# Altium project 3D Printer.PrjPcb
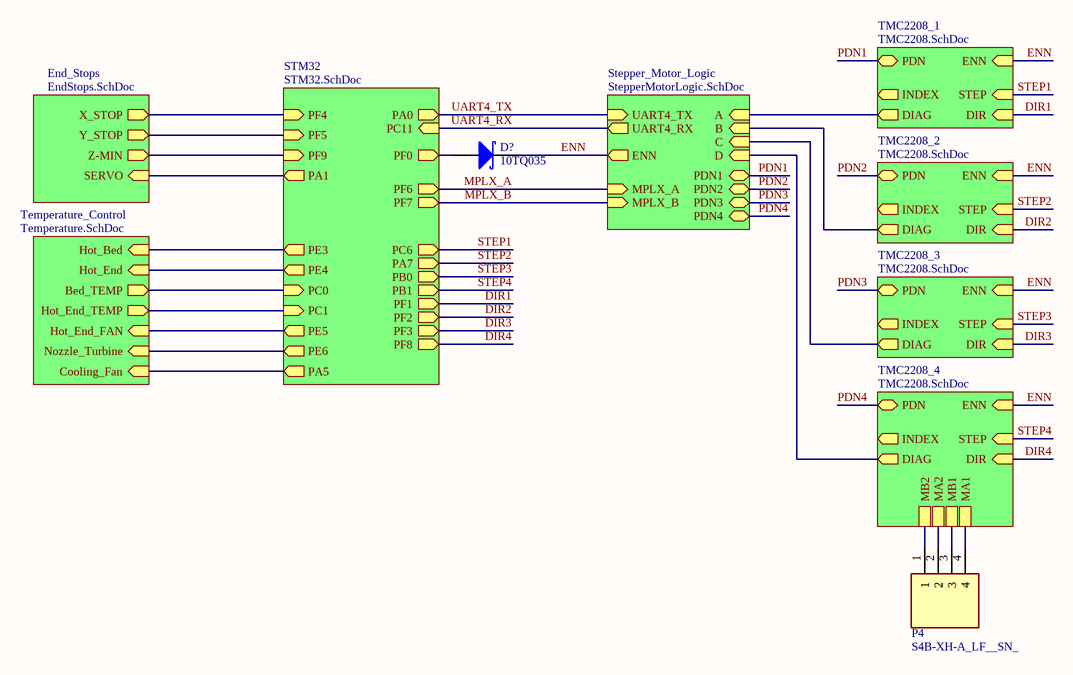
[diagram p0: Motherboard.SchDoc]
7 sheets, 256 parts. Net scope: hierarchical (ports join the sheet entries above them; power ports are global).
Board file: Motherboard.PcbDoc
Sheets:
  Motherboard.SchDoc
    TMC2208_1 = TMC2208.SchDoc
    TMC2208_2 = TMC2208.SchDoc
    TMC2208_3 = TMC2208.SchDoc
    TMC2208_4 = TMC2208.SchDoc
    STM32 = STM32.SchDoc
    Temperature_Control = Temperature.SchDoc
    Stepper_Motor_Logic = StepperMotorLogic.SchDoc
    End_Stops = EndStops.SchDoc
  PowerConversion.SchDoc

## Sheet Motherboard.SchDoc
size D

### Parts
D?  10TQ035  [TO-220AC]
P4  S4B-XH-A_LF__SN_  [SHDRRA4W64P0X250_1X4_1240X1150X700P]

### Sub-sheets
End_Stops = EndStops.SchDoc: X_STOP (out), Y_STOP (out), Z-MIN (out), SERVO (in)
Stepper_Motor_Logic = StepperMotorLogic.SchDoc: A (in), B (in), C (in), D (in), ENN (out), UART4_TX (in), UART4_RX (out), MPLX_A (in), MPLX_B (in), PDN1 (bidir), PDN2 (bidir), PDN3 (bidir), PDN4 (bidir)
STM32 = STM32.SchDoc: PA0 (out), PC11 (in), PF6 (out), PF7 (out), PF0 (out), PC6 (out), PA7 (out), PB0 (out), PB1 (out), PF8 (out), PF1 (out), PF2 (out), PF3 (out), PE3 (out), PE4 (out), PC0 (in), PC1 (in), PE5 (out), PF4 (in), PF5 (in), PE6 (out), PA5 (out), PA1 (out), PF9 (in)
Temperature_Control = Temperature.SchDoc: Hot_Bed (in), Hot_End (in), Bed_TEMP (out), Hot_End_TEMP (out), Hot_End_FAN (in), Nozzle_Turbine (in), Cooling_Fan (in)
TMC2208_1 = TMC2208.SchDoc: ENN (in), PDN (bidir), STEP (in), DIR (in), INDEX (out), DIAG (out)
TMC2208_2 = TMC2208.SchDoc: ENN (in), PDN (bidir), STEP (in), DIR (in), INDEX (out), DIAG (out)
TMC2208_3 = TMC2208.SchDoc: ENN (in), PDN (bidir), STEP (in), DIR (in), INDEX (out), DIAG (out)
TMC2208_4 = TMC2208.SchDoc: ENN (in), PDN (bidir), STEP (in), DIR (in), INDEX (out), DIAG (out), MB2, MA2, MB1, MA1

### Nets
DIR1: sheet TMC2208_1/DIR, sheet STM32/PF1  [project net DIR]
DIR2: sheet TMC2208_2/DIR, sheet STM32/PF2  [project net DIR]
DIR3: sheet TMC2208_3/DIR, sheet STM32/PF3  [project net DIR]
DIR4: sheet TMC2208_4/DIR, sheet STM32/PF8  [project net DIR]
ENN: D?.1(K) ; sheet TMC2208_1/ENN, sheet TMC2208_2/ENN, sheet TMC2208_3/ENN, sheet TMC2208_4/ENN, sheet Stepper_Motor_Logic/ENN
MPLX_A: sheet STM32/PF6, sheet Stepper_Motor_Logic/MPLX_A
MPLX_B: sheet STM32/PF7, sheet Stepper_Motor_Logic/MPLX_B
PDN1: sheet TMC2208_1/PDN, sheet Stepper_Motor_Logic/PDN1
PDN2: sheet TMC2208_2/PDN, sheet Stepper_Motor_Logic/PDN2
PDN3: sheet TMC2208_3/PDN, sheet Stepper_Motor_Logic/PDN3
PDN4: sheet TMC2208_4/PDN, sheet Stepper_Motor_Logic/PDN4
STEP1: sheet TMC2208_1/STEP, sheet STM32/PC6
STEP2: sheet TMC2208_2/STEP, sheet STM32/PA7
STEP3: sheet TMC2208_3/STEP, sheet STM32/PB0
STEP4: sheet TMC2208_4/STEP, sheet STM32/PB1
UART4_RX: sheet STM32/PC11, sheet Stepper_Motor_Logic/UART4_RX
UART4_TX: sheet STM32/PA0, sheet Stepper_Motor_Logic/UART4_TX
Net1_1: sheet STM32/PC0, sheet Temperature_Control/Bed_TEMP
NetC10_TMC2208_4_2: P4.4 ; sheet TMC2208_4/MA1
NetC11_TMC2208_4_2: P4.3 ; sheet TMC2208_4/MB1
NetC12_TMC2208_4_1: P4.2 ; sheet TMC2208_4/MA2
NetC13_TMC2208_4_1: P4.1 ; sheet TMC2208_4/MB2
NetC42_2: sheet STM32/PC1, sheet Temperature_Control/Hot_End_TEMP
NetD?_3: D?.3(A) ; sheet STM32/PF0
NetIC1_TMC2208_1_11: sheet TMC2208_1/DIAG, sheet Stepper_Motor_Logic/A
NetIC1_TMC2208_2_11: sheet TMC2208_2/DIAG, sheet Stepper_Motor_Logic/B
NetIC1_TMC2208_3_11: sheet TMC2208_3/DIAG, sheet Stepper_Motor_Logic/C
NetIC1_TMC2208_4_11: sheet TMC2208_4/DIAG, sheet Stepper_Motor_Logic/D
NetP?#3_1: sheet STM32/PA1, sheet End_Stops/SERVO
NetP?#4_1: sheet STM32/PF9, sheet End_Stops/Z-MIN
NetR2_2: sheet STM32/PE3, sheet Temperature_Control/Hot_Bed
NetR23_2: sheet STM32/PE5, sheet Temperature_Control/Hot_End_FAN
NetR31_2: sheet STM32/PE4, sheet Temperature_Control/Hot_End
NetR?#1_2: sheet STM32/PE6, sheet Temperature_Control/Nozzle_Turbine
NetR?#2_2: sheet STM32/PA5, sheet Temperature_Control/Cooling_Fan
NetR?#13_2: sheet STM32/PF4, sheet End_Stops/X_STOP
NetR?#14_2: sheet STM32/PF5, sheet End_Stops/Y_STOP

### Library data of the parts
D? = Diode 10TQ035: Schottky Rectifier; Note: Terminal 2 is the TAB and is electrically connected to the cathode; Published: 8-Jun-2000; LatestRevisionDate: 17-Jul-2002; LatestRevisionNote: Re-released for DXP Platform.; DatasheetVersion: PD-2.057B; PackageVersion: Feb-1998; PackageReference: TO-220AC; Publisher: Altium Limited; PackageDescription: TO, Thru-Hole, Vertical, Heatsink Mounted; 3 In-Line Leads (1 Absent); Pitch 2.54 mm; ComponentLink1Description: Manufacturer Link; ComponentLink1URL: http://www.irf.com/; ComponentLink2Description: Datasheet; ComponentLink2URL: http://www.irf.com/product-info/datasheets/data/10tq.pdf
P4 = S4B-XH-A_LF__SN_: Connector; Manufacturer_Name: JST (JAPAN SOLDERLESS TERMINALS); Manufacturer_Part_Number: S4B-XH-A(LF)(SN); Datasheet Link: http://www.jst-mfg.com/product/pdf/eng/eXH.pdf; Height: 7mm; Arrow Part Number: S4B-XH-A(LF)(SN); Arrow Price/Stock: https://www.arrow.com/en/products/s4b-xh-a-lf-sn/jst-manufacturing

## Sheet TMC2208.SchDoc
size B
Used 4 times, as channels TMC2208_1, TMC2208_2, TMC2208_3, TMC2208_4. Parts and nets are listed once, with the designators drawn on the sheet.
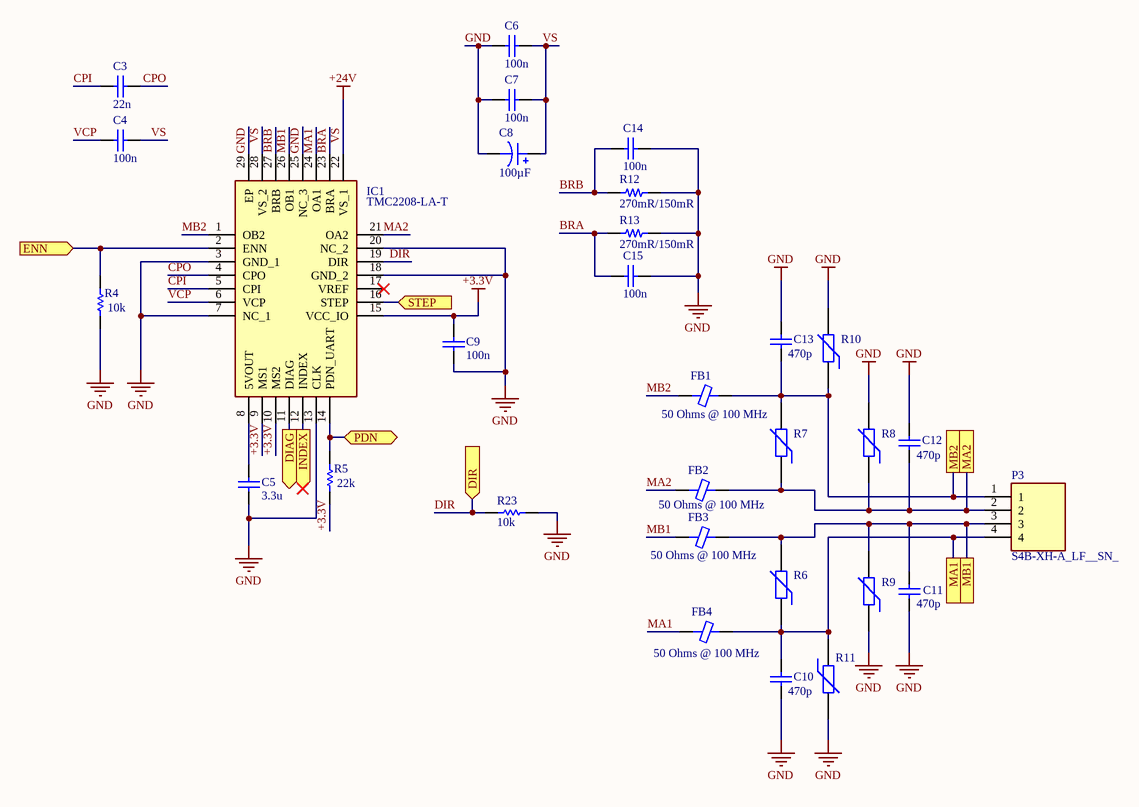
[diagram p1: TMC2208.SchDoc]

### Parts
C3  value 22n  [RAD-0.3]  (hidden comment: Cap)
C4  value 100n  [RAD-0.3]  (hidden comment: Cap)
C5  value 3.3u  [RAD-0.3]  (hidden comment: Cap)
C6  value 100n  [RAD-0.3]  (hidden comment: Cap)
C7  value 100n  [RAD-0.3]  (hidden comment: Cap)
C8  100µF  [CAP ALSMD 8.3MM H10.5MM]
C9  value 100n  [RAD-0.3]  (hidden comment: Cap)
C10  value 470p  [RAD-0.3]  (hidden comment: Cap)
C11  value 470p  [RAD-0.3]  (hidden comment: Cap)
C12  value 470p  [RAD-0.3]  (hidden comment: Cap)
C13  value 470p  [RAD-0.3]  (hidden comment: Cap)
C14  value 100n  [RAD-0.3]  (hidden comment: Cap)
C15  value 100n  [RAD-0.3]  (hidden comment: Cap)
FB1  50 Ohms @ 100 MHz  [FER 1206_3216]
FB2  50 Ohms @ 100 MHz  [FER 1206_3216]
FB3  50 Ohms @ 100 MHz  [FER 1206_3216]
FB4  50 Ohms @ 100 MHz  [FER 1206_3216]
IC1  TMC2208-LA-T  [QFN50P500X500X90-29N-D]
P3  S4B-XH-A_LF__SN_  [SHDRRA4W64P0X250_1X4_1240X1150X700P]
R4  value 10k  [AXIAL-0.3]  (hidden comment: Res1)
R5  value 22k  [AXIAL-0.3]  (hidden comment: Res1)
R6  Res Varistor  [6-0805_N]  (value not drawn)
R7  Res Varistor  [6-0805_N]  (value not drawn)
R8  Res Varistor  [6-0805_N]  (value not drawn)
R9  Res Varistor  [6-0805_N]  (value not drawn)
R10  Res Varistor  [6-0805_N]  (value not drawn)
R11  Res Varistor  [6-0805_N]  (value not drawn)
R12  270mR/150mR  [RES 2512_6432]
R13  270mR/150mR  [RES 2512_6432]
R23  value 10k  [AXIAL-0.3]  (hidden comment: Res1)

### Ports
DIAG (out), DIR (in), ENN (in), INDEX (out), MA1, MA2, MB1, MB2, PDN (bidir), STEP (in)

### Nets
+3.3V: C9.1 IC1.9(MS1) IC1.10(MS2) IC1.15(VCC_IO) R5.1
GND: C5.2 C6.2 C7.2 C8.2 C9.2 C10.1 C11.1 C12.2 C13.2 C14.1 C15.1 IC1.3(GND_1) IC1.7(NC_1) IC1.13(CLK) IC1.18(GND_2) IC1.20(NC_2) IC1.25(NC_3) IC1.29(EP) R4.1 R8.2 R9.1 R10.2 R11.2 R12.1 R13.1 R23.2
VS: C4.1 C6.1 C7.1 C8.1 IC1.22(VS_1) IC1.28(VS_2)  [also labelled +24V]
BRA: C15.2 IC1.23(BRA) R13.2
BRB: C14.2 IC1.27(BRB) R12.2
CPI: C3.2 IC1.5(CPI)
CPO: C3.1 IC1.4(CPO)
DIAG: IC1.11(DIAG) ; port DIAG
DIR: IC1.19(DIR) R23.1 ; port DIR
ENN: IC1.2(ENN) R4.2 ; port ENN
INDEX: IC1.12(INDEX) ; port INDEX
MA1: FB4.1 IC1.24(OA1)
MA1: C10.2 FB4.2 P3.4 R6.1 R11.1 ; port MA1  [a separate net that carries the same name]
MA2: FB2.1 IC1.21(OA2)
MA2: C12.1 FB2.2 P3.2 R7.1 R8.1 ; port MA2  [a separate net that carries the same name]
MB1: FB3.1 IC1.26(OB1)
MB1: C11.2 FB3.2 P3.3 R6.2 R9.2 ; port MB1  [a separate net that carries the same name]
MB2: FB1.1 IC1.1(OB2)
MB2: C13.1 FB1.2 P3.1 R7.2 R10.1 ; port MB2  [a separate net that carries the same name]
PDN: IC1.14(PDN_UART) R5.2 ; port PDN
STEP: IC1.16(STEP) ; port STEP
VCP: C4.2 IC1.6(VCP)
NetC5_1: C5.1 IC1.8(5VOUT)

Not connected (* = marked no-connect by the designer): IC1 17(VREF)*

### Channels
TMC2208_1: designators C3=C3_TMC2208_1 C4=C4_TMC2208_1 C5=C5_TMC2208_1 C6=C6_TMC2208_1 C7=C7_TMC2208_1 C8=C8_TMC2208_1 C9=C9_TMC2208_1 C10=C10_TMC2208_1 C11=C11_TMC2208_1 C12=C12_TMC2208_1 C13=C13_TMC2208_1 C14=C14_TMC2208_1 C15=C15_TMC2208_1 FB1=FB1_TMC2208_1 FB2=FB2_TMC2208_1 FB3=FB3_TMC2208_1 FB4=FB4_TMC2208_1 IC1=IC1_TMC2208_1 P3=J3_TMC2208_1 R4=R4_TMC2208_1 R5=R5_TMC2208_1 R6=R6_TMC2208_1 R7=R7_TMC2208_1 R8=R8_TMC2208_1 R9=R9_TMC2208_1 R10=R10_TMC2208_1 R11=R11_TMC2208_1 R12=R12_TMC2208_1 R13=R13_TMC2208_1 R23=R23_TMC2208_1; ports DIAG=NetIC1_TMC2208_1_11 DIR=DIR ENN=ENN INDEX=NetIC1_TMC2208_1_12 MA1=NetC10_TMC2208_1_2 MA2=NetC12_TMC2208_1_1 MB1=NetC11_TMC2208_1_2 MB2=NetC13_TMC2208_1_1 PDN=PDN1 STEP=STEP1
TMC2208_2: designators C3=C3_TMC2208_2 C4=C4_TMC2208_2 C5=C5_TMC2208_2 C6=C6_TMC2208_2 C7=C7_TMC2208_2 C8=C8_TMC2208_2 C9=C9_TMC2208_2 C10=C10_TMC2208_2 C11=C11_TMC2208_2 C12=C12_TMC2208_2 C13=C13_TMC2208_2 C14=C14_TMC2208_2 C15=C15_TMC2208_2 FB1=FB1_TMC2208_2 FB2=FB2_TMC2208_2 FB3=FB3_TMC2208_2 FB4=FB4_TMC2208_2 IC1=IC1_TMC2208_2 P3=J3_TMC2208_2 R4=R4_TMC2208_2 R5=R5_TMC2208_2 R6=R6_TMC2208_2 R7=R7_TMC2208_2 R8=R8_TMC2208_2 R9=R9_TMC2208_2 R10=R10_TMC2208_2 R11=R11_TMC2208_2 R12=R12_TMC2208_2 R13=R13_TMC2208_2 R23=R23_TMC2208_2; ports DIAG=NetIC1_TMC2208_2_11 DIR=DIR ENN=ENN INDEX=NetIC1_TMC2208_2_12 MA1=NetC10_TMC2208_2_2 MA2=NetC12_TMC2208_2_1 MB1=NetC11_TMC2208_2_2 MB2=NetC13_TMC2208_2_1 PDN=PDN2 STEP=STEP2
TMC2208_3: designators C3=C3_TMC2208_3 C4=C4_TMC2208_3 C5=C5_TMC2208_3 C6=C6_TMC2208_3 C7=C7_TMC2208_3 C8=C8_TMC2208_3 C9=C9_TMC2208_3 C10=C10_TMC2208_3 C11=C11_TMC2208_3 C12=C12_TMC2208_3 C13=C13_TMC2208_3 C14=C14_TMC2208_3 C15=C15_TMC2208_3 FB1=FB1_TMC2208_3 FB2=FB2_TMC2208_3 FB3=FB3_TMC2208_3 FB4=FB4_TMC2208_3 IC1=IC1_TMC2208_3 P3=J3_TMC2208_3 R4=R4_TMC2208_3 R5=R5_TMC2208_3 R6=R6_TMC2208_3 R7=R7_TMC2208_3 R8=R8_TMC2208_3 R9=R9_TMC2208_3 R10=R10_TMC2208_3 R11=R11_TMC2208_3 R12=R12_TMC2208_3 R13=R13_TMC2208_3 R23=R23_TMC2208_3; ports DIAG=NetIC1_TMC2208_3_11 DIR=DIR ENN=ENN INDEX=NetIC1_TMC2208_3_12 MA1=NetC10_TMC2208_3_2 MA2=NetC12_TMC2208_3_1 MB1=NetC11_TMC2208_3_2 MB2=NetC13_TMC2208_3_1 PDN=PDN3 STEP=STEP3
TMC2208_4: designators C3=C3_TMC2208_4 C4=C4_TMC2208_4 C5=C5_TMC2208_4 C6=C6_TMC2208_4 C7=C7_TMC2208_4 C8=C8_TMC2208_4 C9=C9_TMC2208_4 C10=C10_TMC2208_4 C11=C11_TMC2208_4 C12=C12_TMC2208_4 C13=C13_TMC2208_4 C14=C14_TMC2208_4 C15=C15_TMC2208_4 FB1=FB1_TMC2208_4 FB2=FB2_TMC2208_4 FB3=FB3_TMC2208_4 FB4=FB4_TMC2208_4 IC1=IC1_TMC2208_4 P3=J3_TMC2208_4 R4=R4_TMC2208_4 R5=R5_TMC2208_4 R6=R6_TMC2208_4 R7=R7_TMC2208_4 R8=R8_TMC2208_4 R9=R9_TMC2208_4 R10=R10_TMC2208_4 R11=R11_TMC2208_4 R12=R12_TMC2208_4 R13=R13_TMC2208_4 R23=R23_TMC2208_4; ports DIAG=NetIC1_TMC2208_4_11 DIR=DIR ENN=ENN INDEX=NetIC1_TMC2208_4_12 MA1=NetC10_TMC2208_4_2 MA2=NetC12_TMC2208_4_1 MB1=NetC11_TMC2208_4_2 MB2=NetC13_TMC2208_4_1 PDN=PDN4 STEP=STEP4

### Notes on the sheet
- Shortest possible loop
- Shortest path to GND, Isolated from each other
- (near R5) Short wire

### Library data of the parts
C3-C7 C9-C15 = Cap: Capacitor; Published: 8-Jun-2000; LatestRevisionDate: 17-Jul-2002; LatestRevisionNote: Re-released for DXP Platform.; PackageReference: RAD-0.3; Publisher: Altium Limited; PackageDescription: Radial Cap, Thru-Hole; 2 Leads; 0.3 in Pin Spacing
C8 = UUX1V101MNL6GS: CAP ALUM 100UF 20% 35V SMD; manufacturer: Nichicon; Lifetime @ Temp.: 2000 Hrs @ 105°C; Polarization: Polar; Ripple Current @ High Frequency: 367.9mA @ 10kHz; Ripple Current @ Low Frequency: 283mA @ 120Hz; Surface Mount Land Size: 0.327" L x 0.327" W (8.30mm x 8.30mm); Part Number: UUX1V101MNL6GS; Applications: General Purpose; Capacitance: 100µF; componentlink1description: Datasheet; componentlink1url: http://nichicon-us.com/english/products/pdfs/e-uux.pdf; componentlink2description: DigiKey Link; componentlink2url: http://digikey.com/product-detail/en/nichicon/UUX1V101MNL6GS/493-6276-1-ND/3438789; Device Package: Radial, Can - SMD; Height - Seated (Max): 0.413" (10.50mm); lastupdated: 02.09.2020 01:25:15; Lifecycle Status: Active; Minimum Order: 1; Mounting Type: Surface Mount; Operating Temperature: -55°C ~ 105°C; Package / Case: Radial, Can - SMD; packaging: TapeAndReel; partid: 7565; Part Status: Active; price: 0.19; series: UUX; Size / Dimension: 0.315" Dia (8.00mm); Supplier 1: DigiKey; Supplier Part Number 1: 493-6276-1-ND; Tolerance: ±20%; value: 100µF; Voltage - Rated: 35V
FB1-FB4 = ILHB1206ER500V: FERRITE BEAD 50 OHM 1206 1LN; Manufacturer: Vishay Dale; Current Rating (Max): 6A; DC Resistance (DCR) (Max): 20mOhm; Number of Lines: 1; Part Number: ILHB1206ER500V; ComponentLink1Description: Datasheet; ComponentLink1URL: http://www.vishay.com/docs/34102/ilhb.pdf; ComponentLink2Description: DigiKey Link; ComponentLink2URL: https://www.digikey.com/en/products/detail/vishay-dale/ILHB1206ER500V/2575024; Device Package: 1206 (3216 Metric); Height (Max): 0.051" (1.30mm); Impedance @ Frequency: 50 Ohms @ 100 MHz; LastUpdated: 31.07.2022 00:06:55; Lifecycle Status: Active; Minimum Order: 1; Mounting Type: Surface Mount; Operating Temperature: -55°C ~ 125°C; Package / Case: 1206 (3216 Metric); Packaging: TapeAndReel; PartId: 1687; Part Status: Active; Price: 0.06; Series: ILHB; Size / Dimension: 0.126" L x 0.063" W (3.20mm x 1.60mm); Supplier 1: DigiKey; Supplier Part Number 1: 541-2606-1-ND; Value: 50 Ohms @ 100 MHz
IC1 = TMC2208-LA-T: Integrated Circuit; Manufacturer_Name: TRINAMIC; Datasheet Link: https://datasheet.datasheetarchive.com/originals/distributors/DKDS-23/450911.pdf; Height: 0.9mm; Manufacturer_Part_Number: TMC2208-LA-T; Mouser Part Number: 700-TMC2208-LA-T; Mouser Price/Stock: https://www.mouser.co.uk/ProductDetail/Trinamic/TMC2208-LA-T?qs=TiOZkKH1s2TUCbyrI5xF3A%3D%3D
P3 = S4B-XH-A_LF__SN_: as P4 on sheet Motherboard; Datasheet Link: http://www.jst-mfg.com/product/pdf/eng/eXH.pdf; Height: 7mm; Arrow Part Number: S4B-XH-A(LF)(SN); Arrow Price/Stock: https://www.arrow.com/en/products/s4b-xh-a-lf-sn/jst-manufacturing
R4 R5 R23 = Res1: Resistor; Published: 8-Jun-2000; LatestRevisionDate: 17-Jul-2002; LatestRevisionNote: Re-released for DXP Platform.; PackageReference: AXIAL-0.3; Publisher: Altium Limited; PackageDescription: Axial Device, Thru-Hole; 2 Leads; 0.3 in Pin Spacing
R6-R11 = Res Varistor: Varistor (Voltage-Sensitive Resistor); Published: 24-Mar-1999; LatestRevisionDate: 29-May-2009; LatestRevisionNote: IPC-7351 Footprint Added.; PackageVersion: Mar-2003; PackageReference: 6-0805; Publisher: Altium Limited; PackageDescription: Chip Resistor 0805 Case Size; Code_IPC: RESC2012
R12 R13 = RL73H3AR27FTDF: RES 0.27 OHM 1% 1W 2512; Manufacturer: TE Connectivity Passive Product; Resistance: 270 mOhms; Temperature Coefficient: ±100ppm/°C; Value: 270 mOhms; Part Number: RL73H3AR27FTDF; ComponentLink1Description: Datasheet; ComponentLink1URL: https://www.te.com/commerce/DocumentDelivery/DDEController?Action=srchrtrv&DocNm=1773269&DocType=DS&DocLang=English; ComponentLink2Description: DigiKey Link; ComponentLink2URL: http://digikey.com/product-detail/en/te-connectivity-passive-product/RL73H3AR27FTDF/A138622CT-ND/9372023; Composition: Thick Film; Device Package: 2512 (6432 Metric); Features: Current Sense; Height - Seated (Max): 0.028" (0.70mm); LastUpdated: 02.09.2020 01:26:50; Lifecycle Status: Active; Minimum Order: 1; Number of Terminations: 2; Operating Temperature: -55°C ~ 155°C; Package / Case: 2512 (6432 Metric); Packaging: TapeAndReel; Part Status: Active; Power (Watts): 1W; Price: 0.19; Series: RL73, CGS; Size / Dimension: 0.250" L x 0.122" W (6.35mm x 3.10mm); Supplier 1: DigiKey; Supplier Part Number 1: A138622CT-ND; Supplier Device Package: 2512; Tolerance: ±1%

## Sheet STM32.SchDoc
size B
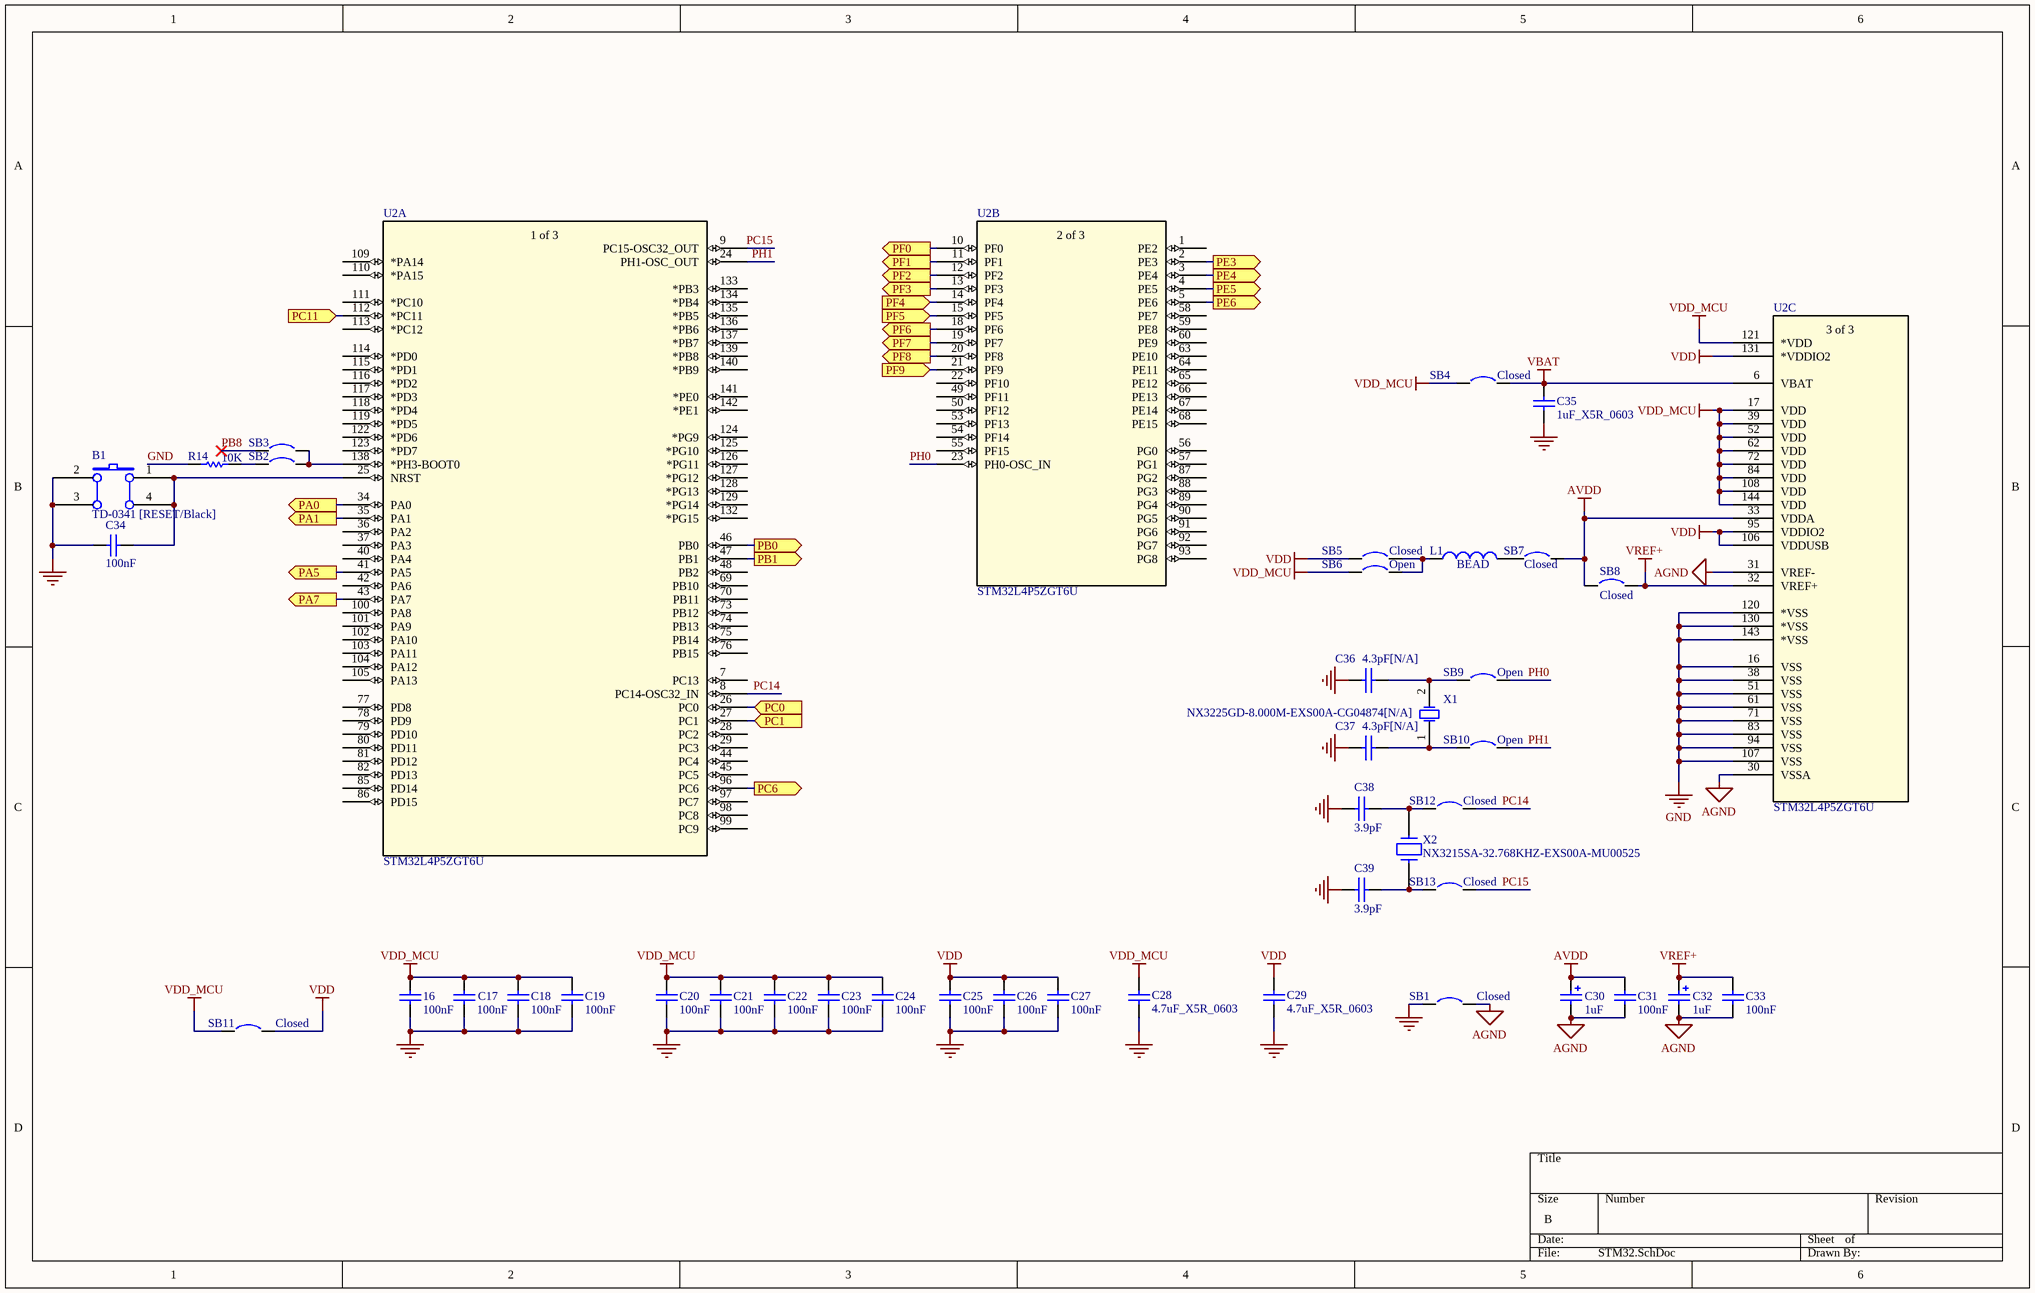
[diagram p2: STM32.SchDoc]

### Parts
16  100nF  [0603C]
B1  TD-0341 [RESET/Black]  [PB-6X6mm-Black]
C17  100nF  [0603C]
C18  100nF  [0603C]
C19  100nF  [0603C]
C20  100nF  [0603C]
C21  100nF  [0603C]
C22  100nF  [0603C]
C23  100nF  [0603C]
C24  100nF  [0603C]
C25  100nF  [0603C]
C26  100nF  [0603C]
C27  100nF  [0603C]
C28  4.7uF_X5R_0603  [0603C]
C29  4.7uF_X5R_0603  [0603C]
C30  value 1uF  [TAN-A]  (hidden comment: TAJA105K016R)
C31  100nF  [0603C]
C32  value 1uF  [TAN-A]  (hidden comment: TAJA105K016R)
C33  100nF  [0603C]
C34  100nF  [0603C]
C35  1uF_X5R_0603  [0603C]
C36  4.3pF[N/A]  [0603C]
C37  4.3pF[N/A]  [0603C]
C38  3.9pF  [0603C]
C39  3.9pF  [0603C]
L1  BEAD  [0603L]
R14  10K  [0603R]
SB1  Closed  [SB_0603]
SB2  Circuit Breaker  [SB_0603]  (value not drawn)
SB3  Circuit Breaker  [SB_0603]  (value not drawn)
SB4  Closed  [SB_0603]
SB5  Closed  [SB_0603]
SB6  Open  [SB_0603]
SB7  Closed  [SB_0603]
SB8  Closed  [SB_0603]
SB9  Open  [SB_0603]
SB10  Open  [SB_0603]
SB11  Closed  [SB_0603]
SB12  Closed  [SB_0603]
SB13  Closed  [SB_0603]
U2  STM32L4P5ZGT6U  [LQFP144_STM32_STM]  (parts A,B,C of 3)
X1  NX3225GD-8.000M-EXS00A-CG04874[N/A]  [OSC_2SM_3R2x2R5]
X2  NX3215SA-32.768KHZ-EXS00A-MU00525  [XTAL_2SM_3R2X1R5]

### Ports
PA0 (out), PA1 (out), PA5 (out), PA7 (out), PB0 (out), PB1 (out), PC0 (in), PC1 (in), PC6 (out), PC11 (in), PE3 (out), PE4 (out), PE5 (out), PE6 (out), PF0 (out), PF1 (out), PF2 (out), PF3 (out), PF4 (in), PF5 (in), PF6 (out), PF7 (out), PF8 (out), PF9 (in)

### Nets
AGND: C30.2 C31.2 C32.2 C33.2 SB1.2 U2.30(VSSA) U2.31(VREF-)
AVDD: C30.1 C31.1 SB7.2 SB8.1 U2.33(VDDA)
GND: 16.2 B1.2(B0) B1.3(B1) C17.2 C18.2 C19.2 C20.2 C21.2 C22.2 C23.2 C24.2 C25.2 C26.2 C27.2 C28.2 C29.2 C34.2 C35.2 C36.2 C37.2 C38.2 C39.2 R14.2 SB1.1 U2.16(VSS) U2.38(VSS) U2.51(VSS) U2.61(VSS) U2.71(VSS) U2.83(VSS) U2.94(VSS) U2.107(VSS) U2.120(*VSS) U2.130(*VSS) U2.143(*VSS)
VBAT: C35.1 SB4.2 U2.6(VBAT)
VDD: C25.1 C26.1 C27.1 C29.1 SB5.1 SB11.2 U2.95(VDDIO2) U2.106(VDDUSB) U2.131(*VDDIO2)
VDD_MCU: 16.1 C17.1 C18.1 C19.1 C20.1 C21.1 C22.1 C23.1 C24.1 C28.1 SB4.1 SB6.1 SB11.1 U2.17(VDD) U2.39(VDD) U2.52(VDD) U2.62(VDD) U2.72(VDD) U2.84(VDD) U2.108(VDD) U2.121(*VDD) U2.144(VDD)
VREF+: C32.1 C33.1 SB8.2 U2.32(VREF+)
DIR: U2.11(PF1) ; port PF1
DIR: U2.12(PF2) ; port PF2  [a separate net that carries the same name]
DIR: U2.13(PF3) ; port PF3  [a separate net that carries the same name]
DIR: U2.20(PF8) ; port PF8  [a separate net that carries the same name]
MPLX_A: U2.18(PF6) ; port PF6
MPLX_B: U2.19(PF7) ; port PF7
PB8: SB3.1
PC14: SB12.2 U2.8(PC14-OSC32_IN)
PC15: SB13.2 U2.9(PC15-OSC32_OUT)
PH0: SB9.2 U2.23(PH0-OSC_IN)
PH1: SB10.2 U2.24(PH1-OSC_OUT)
STEP1: U2.96(PC6) ; port PC6
STEP2: U2.43(PA7) ; port PA7
STEP3: U2.46(PB0) ; port PB0
STEP4: U2.47(PB1) ; port PB1
UART4_RX: U2.112(*PC11) ; port PC11
UART4_TX: U2.34(PA0) ; port PA0
Net1_1: U2.26(PC0) ; port PC0
NetB1_1: B1.1(A0) B1.4(A1) C34.1 U2.25(NRST)
NetC36_1: C36.1 SB9.1 X1.2(OSC2)
NetC37_1: C37.1 SB10.1 X1.1(OSC1)
NetC38_1: C38.1 SB12.1 X2.1
NetC39_1: C39.1 SB13.1 X2.2
NetC42_2: U2.27(PC1) ; port PC1
NetD?_3: U2.10(PF0) ; port PF0
NetL1_1: L1.1 SB5.2 SB6.2
NetL1_2: L1.2 SB7.1
NetP?#3_1: U2.35(PA1) ; port PA1
NetP?#4_1: U2.21(PF9) ; port PF9
NetR2_2: U2.2(PE3) ; port PE3
NetR14_1: R14.1 SB2.1
NetR23_2: U2.4(PE5) ; port PE5
NetR31_2: U2.3(PE4) ; port PE4
NetR?#1_2: U2.5(PE6) ; port PE6
NetR?#2_2: U2.41(PA5) ; port PA5
NetR?#13_2: U2.14(PF4) ; port PF4
NetR?#14_2: U2.15(PF5) ; port PF5
NetSB2_2: SB2.2 SB3.2 U2.138(*PH3-BOOT0)

Not connected (* = marked no-connect by the designer): U2 1(PE2) 7(PC13) 22(PF10) 28(PC2) 29(PC3) 36(PA2) 37(PA3) 40(PA4) 42(PA6) 44(PC4) 45(PC5) 48(PB2) 49(PF11) 50(PF12) 53(PF13) 54(PF14) 55(PF15) 56(PG0) 57(PG1) 58(PE7) 59(PE8) 60(PE9) 63(PE10) 64(PE11) 65(PE12) 66(PE13) 67(PE14) 68(PE15) 69(PB10) 70(PB11) 73(PB12) 74(PB13) 75(PB14) 76(PB15) 77(PD8) 78(PD9) 79(PD10) 80(PD11) 81(PD12) 82(PD13) 85(PD14) 86(PD15) 87(PG2) 88(PG3) 89(PG4) 90(PG5) 91(PG6) 92(PG7) 93(PG8) 97(PC7) 98(PC8) 99(PC9) 100(PA8) 101(PA9) 102(PA10) 103(PA11) 104(PA12) 105(PA13) 109(*PA14) 110(*PA15) 111(*PC10) 113(*PC12) 114(*PD0) 115(*PD1) 116(*PD2) 117(*PD3) 118(*PD4) 119(*PD5) 122(*PD6) 123(*PD7) 124(*PG9) 125(*PG10) 126(*PG11) 127(*PG12) 128(*PG13) 129(*PG14) 132(*PG15) 133(*PB3) 134(*PB4) 135(*PB5) 136(*PB6) 137(*PB7) 139(*PB8) 140(*PB9) 141(*PE0) 142(*PE1)

### Notes on the sheet
- (in symbol STM32L4P5ZGT6U, part A) 1 of 3
- (in symbol STM32L4P5ZGT6U, part B) 2 of 3
- (in symbol STM32L4P5ZGT6U, part C) 3 of 3

### Library data of the parts
16 C17-C27 C31 C33 = Cap: Capacitor; Value: 10nF; Published: 8-Jun-2000; Revision: July-2002: Re-released for DXP Platform.; Publisher: Altium Limited
B1 = SW PUSHBUTTON: SE PUSHBUTTON
C28 C29 = CAP SMD 0603  X5R 1µF 25V 10%: 0603  X5R 4.7uF; Value: 1µF; Rated voltage: 25V; Tolerance: 10%; Manufacturer: *; Manufacturer P/N: *; Order code Farnell: 1288202RL; Power: *; Technology: X5R; Temperature  Factor: *; Temperature Max: +125°C; Temperature Min: -55°C; STS Code: *
C30 C32 = Cap Pol1: Tan Capacitor,1uF,10%,16V,Tan-A,TAJA105K016R; Manuf_1: AVX; Ordered by: Subcon; ECCN_US/EU: NA; Published: 8-Jun-2000; Revision: July-2002: Re-released for DXP Platform.; Publisher: Altium Limited; Manuf_Part_1: TAJA105K016R
C34 = CAP: Capacitor; Value: 100pF; Published: 8-Jun-2000; Revision: July-2002: Re-released for DXP Platform.; Publisher: Altium Limited
C35 = CAP SMD 0603  X5R 1µF 25V 10%: 0603  X5R 1µF; Rated voltage: 25V; Tolerance: 10%; Manufacturer: *; Manufacturer P/N: *; Order code Farnell: 1288202RL; Value: 1µF; Power: *; Technology: X5R; Temperature  Factor: *; Temperature Max: +125°C; Temperature Min: -55°C; STS Code: *
C36-C39 = CAP: Capacitor
L1 = Inductor: Value: 100uH; Published: 8-Jun-2000; Revision: July-2002: Re-released for DXP Platform.; Publisher: Altium Limited
R14 = res1: Resistor; Value: 1K; Published: 8-Jun-2000; Revision: July-2002: Re-released for DXP Platform.; Publisher: Altium Limited
SB1 SB4 SB5 SB7 SB8 SB11 = Circuit Breaker_close: Circuit Breaker; Published: 24-Mar-1999; Revision: July-2002: Re-released for DXP Platform.; Publisher: Altium Limited
SB2 SB3 = Circuit Breaker: Solder: NO; Published: 24-Mar-1999; Revision: July-2002: Re-released for DXP Platform.; Publisher: Altium Limited
SB6 SB9 SB10 SB12 SB13 = Circuit Breaker: Published: 24-Mar-1999; Revision: July-2002: Re-released for DXP Platform.; Publisher: Altium Limited
U2 = STM32L4P5ZGT6U: No Description Available; Mfr_Name: STMicroelectronics; Copyright: Copyright (C) 2022 Ultra Librarian. All rights reserved.; Manufacturer_Part_Number: STM32L4P5ZGT6U; RefDes: RefDes; Type: DEV
X1 = XTAL: Crystal Oscillator; Published: 8-Jun-2000; LatestRevisionDate: 17-Jul-2002; LatestRevisionNote: Re-released for DXP Platform.; PackageReference: R38; Publisher: Altium Limited
X2 = CRYSTAL_32K: Crystal

## Sheet Temperature.SchDoc
size B
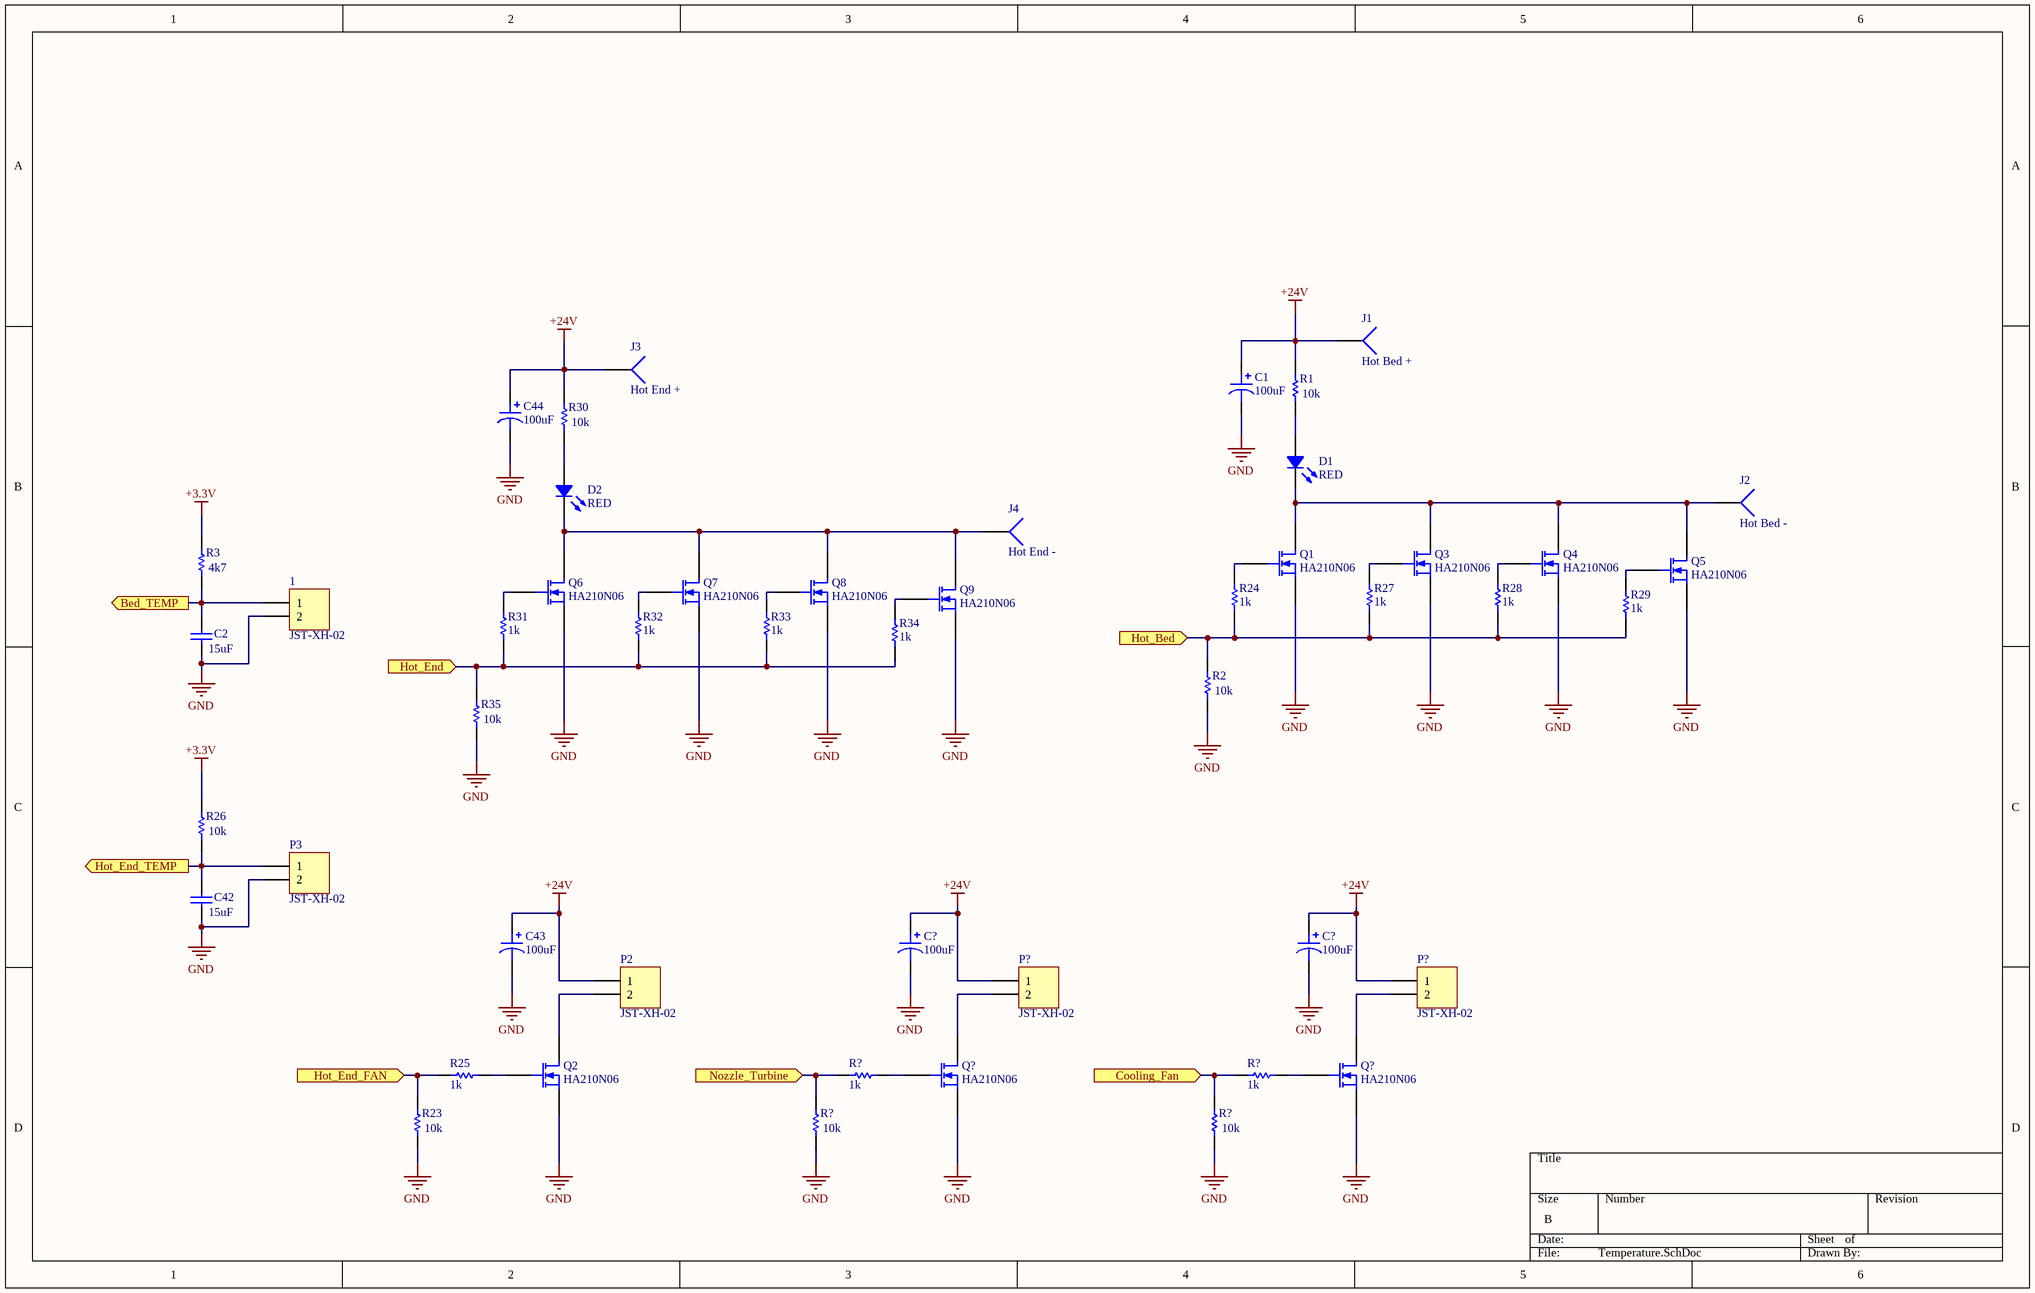
[diagram p3: Temperature.SchDoc]

### Parts
(Parts that share a designator on the sheet are numbered #1, #2 ... from top to bottom, then left to right.)
1  JST-XH-02  [HDR1X2]
C1  100uF  [CAP ALSMD 8.3MM H10.5MM]
C2  value 15uF  [RAD-0.3]  (hidden comment: Cap)
C42  value 15uF  [RAD-0.3]  (hidden comment: Cap)
C43  100uF  [CAP ALSMD 8.3MM H10.5MM]
C44  100uF  [CAP ALSMD 8.3MM H10.5MM]
C?#1  100uF  [CAP ALSMD 8.3MM H10.5MM]
C?#2  100uF  [CAP ALSMD 8.3MM H10.5MM]
D1  RED  [Broadcom 4-PLLC 3228]
D2  RED  [Broadcom 4-PLLC 3228]
J1  Hot Bed +  [PIN1]
J2  Hot Bed -  [PIN1]
J3  Hot End +  [PIN1]
J4  Hot End -  [PIN1]
P2  JST-XH-02  [HDR1X2]
P3  JST-XH-02  [HDR1X2]
P?#1  JST-XH-02  [HDR1X2]
P?#2  JST-XH-02  [HDR1X2]
Q1  HA210N06  [E3]
Q2  HA210N06  [E3]
Q3  HA210N06  [E3]
Q4  HA210N06  [E3]
Q5  HA210N06  [E3]
Q6  HA210N06  [E3]
Q7  HA210N06  [E3]
Q8  HA210N06  [E3]
Q9  HA210N06  [E3]
Q?#1  HA210N06  [E3]
Q?#2  HA210N06  [E3]
R1  value 10k  [AXIAL-0.3]  (hidden comment: Res1)
R2  value 10k  [AXIAL-0.3]  (hidden comment: Res1)
R3  value 4k7  [AXIAL-0.3]  (hidden comment: Res1)
R23  value 10k  [AXIAL-0.3]  (hidden comment: Res1)
R24  value 1k  [AXIAL-0.3]  (hidden comment: Res1)
R25  value 1k  [AXIAL-0.3]  (hidden comment: Res1)
R26  value 10k  [AXIAL-0.3]  (hidden comment: Res1)
R27  value 1k  [AXIAL-0.3]  (hidden comment: Res1)
R28  value 1k  [AXIAL-0.3]  (hidden comment: Res1)
R29  value 1k  [AXIAL-0.3]  (hidden comment: Res1)
R30  value 10k  [AXIAL-0.3]  (hidden comment: Res1)
R31  value 1k  [AXIAL-0.3]  (hidden comment: Res1)
R32  value 1k  [AXIAL-0.3]  (hidden comment: Res1)
R33  value 1k  [AXIAL-0.3]  (hidden comment: Res1)
R34  value 1k  [AXIAL-0.3]  (hidden comment: Res1)
R35  value 10k  [AXIAL-0.3]  (hidden comment: Res1)
R?#1  value 1k  [AXIAL-0.3]  (hidden comment: Res1)
R?#2  value 1k  [AXIAL-0.3]  (hidden comment: Res1)
R?#3  value 10k  [AXIAL-0.3]  (hidden comment: Res1)
R?#4  value 10k  [AXIAL-0.3]  (hidden comment: Res1)

### Ports
Bed_TEMP (out), Cooling_Fan (in), Hot_Bed (in), Hot_End (in), Hot_End_FAN (in), Hot_End_TEMP (out), Nozzle_Turbine (in)

### Nets
+3.3V: R3.2 R26.2
+24V: C1.1 C43.1 C44.1 C?#1.1 C?#2.1 J1.1 J3.1 P2.1 P?#1.1 P?#2.1 R1.2 R30.2  [project net VS]
GND: 1.2 C1.2 C2.1 C42.1 C43.2 C44.2 C?#1.2 C?#2.2 P3.2 Q1.3(S) Q2.3(S) Q3.3(S) Q4.3(S) Q5.3(S) Q6.3(S) Q7.3(S) Q8.3(S) Q9.3(S) Q?#1.3(S) Q?#2.3(S) R2.1 R23.1 R35.1 R?#3.1 R?#4.1
Net1_1: 1.1 C2.2 R3.1 ; port Bed_TEMP
NetC42_2: C42.2 P3.1 R26.1 ; port Hot_End_TEMP
NetD1_1: D1.1 R1.1
NetD1_2: D1.2 J2.1 Q1.1(D) Q3.1(D) Q4.1(D) Q5.1(D)
NetD2_1: D2.1 R30.1
NetD2_2: D2.2 J4.1 Q6.1(D) Q7.1(D) Q8.1(D) Q9.1(D)
NetP2_2: P2.2 Q2.1(D)
NetP?#1_2: P?#1.2 Q?#1.1(D)
NetP?#2_2: P?#2.2 Q?#2.1(D)
NetQ1_2: Q1.2(G) R24.1
NetQ2_2: Q2.2(G) R25.1
NetQ3_2: Q3.2(G) R27.1
NetQ4_2: Q4.2(G) R28.1
NetQ5_2: Q5.2(G) R29.1
NetQ6_2: Q6.2(G) R31.1
NetQ7_2: Q7.2(G) R32.1
NetQ8_2: Q8.2(G) R33.1
NetQ9_2: Q9.2(G) R34.1
NetQ?#1_2: Q?#1.2(G) R?#1.1
NetQ?#2_2: Q?#2.2(G) R?#2.1
NetR2_2: R2.2 R24.2 R27.2 R28.2 R29.2 ; port Hot_Bed
NetR23_2: R23.2 R25.2 ; port Hot_End_FAN
NetR31_2: R31.2 R32.2 R33.2 R34.2 R35.2 ; port Hot_End
NetR?#1_2: R?#1.2 R?#3.2 ; port Nozzle_Turbine
NetR?#2_2: R?#2.2 R?#4.2 ; port Cooling_Fan

### Library data of the parts
1 P2 P3 P?#1 P?#2 = Header 2: Header, 2-Pin; LatestRevisionDate: 17-Jul-2002; LatestRevisionNote: Re-released for DXP Platform.; Publisher: Altium Limited
C1 C43 C44 C?#1 C?#2 = UUX1V101MNL6GS: CAP ALUM 100UF 20% 35V SMD; manufacturer: Nichicon; Capacitance: 100µF; Lifetime @ Temp.: 2000 Hrs @ 105°C; Polarization: Polar; Ripple Current @ High Frequency: 367.9mA @ 10kHz; Ripple Current @ Low Frequency: 283mA @ 120Hz; Surface Mount Land Size: 0.327" L x 0.327" W (8.30mm x 8.30mm); value: 100µF; Part Number: UUX1V101MNL6GS; Applications: General Purpose; componentlink1description: Datasheet; componentlink1url: http://nichicon-us.com/english/products/pdfs/e-uux.pdf; componentlink2description: DigiKey Link; componentlink2url: http://digikey.com/product-detail/en/nichicon/UUX1V101MNL6GS/493-6276-1-ND/3438789; Device Package: Radial, Can - SMD; Height - Seated (Max): 0.413" (10.50mm); lastupdated: 02.09.2020 01:25:15; Lifecycle Status: Active; Minimum Order: 1; Mounting Type: Surface Mount; Operating Temperature: -55°C ~ 105°C; Package / Case: Radial, Can - SMD; packaging: TapeAndReel; partid: 7565; Part Status: Active; price: 0.19; series: UUX; Size / Dimension: 0.315" Dia (8.00mm); Supplier 1: DigiKey; Supplier Part Number 1: 493-6276-1-ND; Tolerance: ±20%; Voltage - Rated: 35V
C2 C42 = Cap: Capacitor; Published: 8-Jun-2000; LatestRevisionDate: 17-Jul-2002; LatestRevisionNote: Re-released for DXP Platform.; PackageReference: RAD-0.3; Publisher: Altium Limited; PackageDescription: Radial Cap, Thru-Hole; 2 Leads; 0.3 in Pin Spacing
D1 D2 = ASMT-QABD-AEF0E: LED INDICATOR 0.5W AMBER 4PLCC; Manufacturer: Broadcom Limited; Current - Max: 300mA; Current - Test: 150mA; Flux @ Current/Temperature - Test: 16lm (12lm ~ 20lm); Lumens/Watt @ Current - Test: 46 lm/W; Temperature - Test: 25°C; Viewing Angle: 120°; Voltage - Forward (Vf) (Typ): 2.3V; Wavelength: 591nm (583nm ~ 598nm); Part Number: ASMT-QABD-AEF0E; Color: Amber; ComponentLink1Description: Datasheet; ComponentLink1URL: https://docs.broadcom.com/docs/AV02-1841EN; ComponentLink2Description: DigiKey Link; ComponentLink2URL: http://digikey.com/product-detail/en/broadcom-limited/ASMT-QABD-AEF0E/516-2949-1-ND/4240264; Device Package: 4-PLCC; Height - Seated (Max): 0.083" (2.10mm); LastUpdated: 24.04.2020 00:55:47; Lifecycle Status: Active; Minimum Order: 1; Mounting Type: Surface Mount; Package / Case: 4-PLCC; Packaging: TapeAndReel; Part Status: Active; Price: 0.42; Series: -; Size / Dimension: 0.126" L x 0.110" W (3.20mm x 2.80mm); Supplier 1: DigiKey; Supplier Part Number 1: 516-2949-1-ND; Supplier Device Package: 4-PLCC
J1-J4 = Socket: LatestRevisionDate: 17-Jul-2002; LatestRevisionNote: Re-released for DXP Platform.; Publisher: Altium Limited
Q1-Q9 Q?#1 Q?#2 = MOSFET-N: N-Channel MOSFET; Published: 8-Jun-2000; LatestRevisionDate: 17-Jul-2002; LatestRevisionNote: Re-released for DXP Platform.; PackageVersion: 1995/1996; PackageReference: E3; Publisher: Altium Limited; PackageDescription: TO, Flat Index; 3 In-Line, Axial Leads; Body Dia. 4.6mm; Lead Dia. 0.5 mm (max)
R1-R3 R23-R35 R?#1-R?#4 = Res1: Resistor; Published: 8-Jun-2000; LatestRevisionDate: 17-Jul-2002; LatestRevisionNote: Re-released for DXP Platform.; PackageReference: AXIAL-0.3; Publisher: Altium Limited; PackageDescription: Axial Device, Thru-Hole; 2 Leads; 0.3 in Pin Spacing

## Sheet StepperMotorLogic.SchDoc
size B
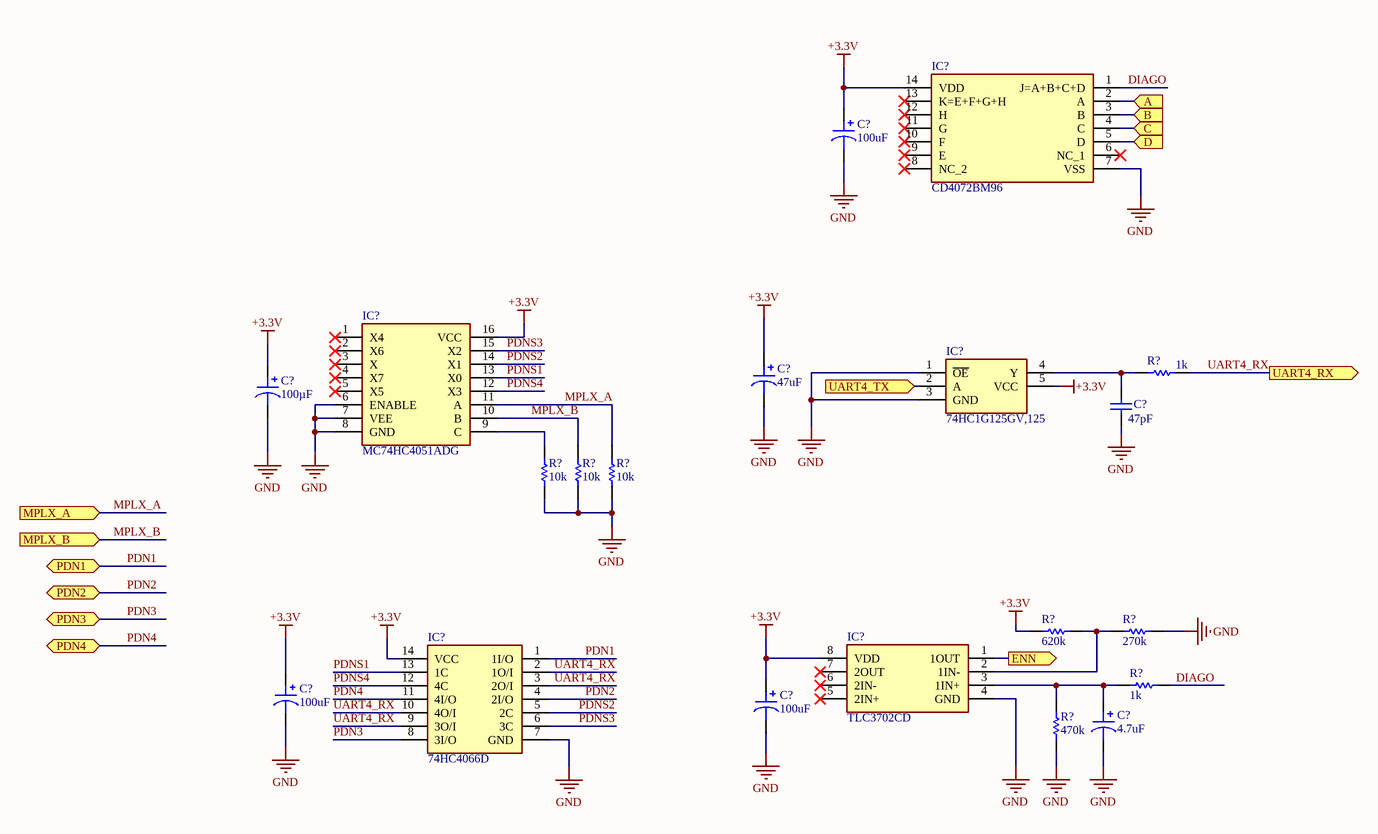
[diagram p4: StepperMotorLogic.SchDoc]

### Parts
(Parts that share a designator on the sheet are numbered #1, #2 ... from top to bottom, then left to right.)
C?#3  100uF  [CAP ALSMD 8.3MM H10.5MM]
C?#4  47uF  [CAP ALSMD 8.3MM H10.5MM]
C?#5  100µF  [CAP ALSMD 8.3MM H10.5MM]
C?#6  value 47pF  [RAD-0.3]  (hidden comment: Cap)
C?#7  100uF  [CAP ALSMD 8.3MM H10.5MM]
C?#8  100uF  [CAP ALSMD 8.3MM H10.5MM]
C?#9  4.7uF  [CAP ALSMD 8.3MM H10.5MM]
IC?#1  CD4072BM96  [SOIC127P600X175-14N]
IC?#2  MC74HC4051ADG  [SOIC127P600X175-16N]
IC?#3  74HC1G125GV,125  [SOT95P275X110-5N]
IC?#4  74HC4066D  [SOIC127P600X175-14N]
IC?#5  TLC3702CD  [SOIC127P600X175-8N]
R?#5  value 1k  [AXIAL-0.3]  (hidden comment: Res1)
R?#6  value 10k  [AXIAL-0.3]  (hidden comment: Res1)
R?#7  value 10k  [AXIAL-0.3]  (hidden comment: Res1)
R?#8  value 10k  [AXIAL-0.3]  (hidden comment: Res1)
R?#9  value 620k  [AXIAL-0.3]  (hidden comment: Res1)
R?#10  value 270k  [AXIAL-0.3]  (hidden comment: Res1)
R?#11  value 1k  [AXIAL-0.3]  (hidden comment: Res1)
R?#12  value 470k  [AXIAL-0.3]  (hidden comment: Res1)

### Ports
A (in), B (in), C (in), D (in), ENN (out), MPLX_A (in), MPLX_B (in), PDN1 (bidir), PDN2 (bidir), PDN3 (bidir), PDN4 (bidir), UART4_RX (out), UART4_TX (in)

### Nets
+3.3V: C?#3.1 C?#4.1 C?#5.1 C?#7.1 C?#8.1 IC?#1.14(VDD) IC?#2.16(VCC) IC?#3.5(VCC) IC?#4.14(VCC) IC?#5.8(VDD) R?#9.2
GND: C?#3.2 C?#4.2 C?#5.2 C?#6.1 C?#7.2 C?#8.2 C?#9.2 IC?#1.7(VSS) IC?#2.6(ENABLE) IC?#2.7(VEE) IC?#2.8(GND) IC?#3.1(~{OE}) IC?#3.3(GND) IC?#4.7(GND) IC?#5.4(GND) R?#6.1 R?#7.1 R?#8.1 R?#10.1 R?#12.1
DIAGO: IC?#1.1(J=A+B+C+D) R?#11.2
ENN: IC?#5.1(1OUT) ; port ENN
MPLX_A: IC?#2.11(A) R?#8.2 ; port MPLX_A
MPLX_B: IC?#2.10(B) R?#7.2 ; port MPLX_B
PDN1: IC?#4.1(1I/O) ; port PDN1
PDN2: IC?#4.4(2I/O) ; port PDN2
PDN3: IC?#4.8(3I/O) ; port PDN3
PDN4: IC?#4.11(4I/O) ; port PDN4
PDNS1: IC?#2.13(X0) IC?#4.13(1C)
PDNS2: IC?#2.14(X1) IC?#4.5(2C)
PDNS3: IC?#2.15(X2) IC?#4.6(3C)
PDNS4: IC?#2.12(X3) IC?#4.12(4C)
UART4_RX: IC?#4.2(1O/I) IC?#4.3(2O/I) IC?#4.9(3O/I) IC?#4.10(4O/I) R?#5.1 ; port UART4_RX
UART4_TX: IC?#3.2(A) ; port UART4_TX
NetC?#6_2: C?#6.2 IC?#3.4(Y) R?#5.2
NetC?#9_1: C?#9.1 IC?#5.3(1IN+) R?#11.1 R?#12.2
NetIC1_TMC2208_1_11: IC?#1.2(A) ; port A
NetIC1_TMC2208_2_11: IC?#1.3(B) ; port B
NetIC1_TMC2208_3_11: IC?#1.4(C) ; port C
NetIC1_TMC2208_4_11: IC?#1.5(D) ; port D
NetIC?#2_9: IC?#2.9(C) R?#6.2
NetIC?#5_2: IC?#5.2(1IN-) R?#9.1 R?#10.2

Not connected (* = marked no-connect by the designer): IC?#1 6(NC_1)* 8(NC_2)* 9(E)* 10(F)* 11(G)* 12(H)* 13(K=E+F+G+H)*; IC?#2 1(X4)* 2(X6)* 3(X)* 4(X7)* 5(X5)*; IC?#5 5(2IN+)* 6(2IN-)* 7(2OUT)*

### Library data of the parts
C?#3 C?#4 C?#7-C?#9 = UUX1V101MNL6GS: as C1 on sheet Temperature; Part Number: UUX1V101MNL6GS; Applications: General Purpose; componentlink1description: Datasheet; componentlink1url: http://nichicon-us.com/english/products/pdfs/e-uux.pdf; componentlink2description: DigiKey Link; componentlink2url: http://digikey.com/product-detail/en/nichicon/UUX1V101MNL6GS/493-6276-1-ND/3438789; Device Package: Radial, Can - SMD; Height - Seated (Max): 0.413" (10.50mm); lastupdated: 02.09.2020 01:25:15; Lifecycle Status: Active; Minimum Order: 1; Mounting Type: Surface Mount; Operating Temperature: -55°C ~ 105°C; Package / Case: Radial, Can - SMD; packaging: TapeAndReel; partid: 7565; Part Status: Active; price: 0.19; series: UUX; Size / Dimension: 0.315" Dia (8.00mm); Supplier 1: DigiKey; Supplier Part Number 1: 493-6276-1-ND; Tolerance: ±20%; Voltage - Rated: 35V
C?#5 = UUX1V101MNL6GS: as C8 on sheet TMC2208; Part Number: UUX1V101MNL6GS; Applications: General Purpose; Capacitance: 100µF; componentlink1description: Datasheet; componentlink1url: http://nichicon-us.com/english/products/pdfs/e-uux.pdf; componentlink2description: DigiKey Link; componentlink2url: http://digikey.com/product-detail/en/nichicon/UUX1V101MNL6GS/493-6276-1-ND/3438789; Device Package: Radial, Can - SMD; Height - Seated (Max): 0.413" (10.50mm); lastupdated: 02.09.2020 01:25:15; Lifecycle Status: Active; Minimum Order: 1; Mounting Type: Surface Mount; Operating Temperature: -55°C ~ 105°C; Package / Case: Radial, Can - SMD; packaging: TapeAndReel; partid: 7565; Part Status: Active; price: 0.19; series: UUX; Size / Dimension: 0.315" Dia (8.00mm); Supplier 1: DigiKey; Supplier Part Number 1: 493-6276-1-ND; Tolerance: ±20%; value: 100µF; Voltage - Rated: 35V
C?#6 = Cap: Capacitor; Published: 8-Jun-2000; LatestRevisionDate: 17-Jul-2002; LatestRevisionNote: Re-released for DXP Platform.; PackageReference: RAD-0.3; Publisher: Altium Limited; PackageDescription: Radial Cap, Thru-Hole; 2 Leads; 0.3 in Pin Spacing
IC?#1 = CD4072BM96: Integrated Circuit; Manufacturer_Name: Texas Instruments; Datasheet Link: http://www.ti.com/lit/gpn/cd4072b; Height: 1.75mm; Manufacturer_Part_Number: CD4072BM96; Mouser Part Number: 595-CD4072BM96; Mouser Price/Stock: https://www.mouser.co.uk/ProductDetail/Texas-Instruments/CD4072BM96?qs=HTr%252BoA4jRimdX2EbrLvk9A%3D%3D; Arrow Part Number: CD4072BM96; Arrow Price/Stock: https://www.arrow.com/en/products/cd4072bm96/texas-instruments?region=nac
IC?#2 = MC74HC4051ADG: Integrated Circuit; Manufacturer_Name: onsemi; Datasheet Link: http://www.onsemi.com/pub/Collateral/MC74HC4051A-D.PDF; Height: 1.75mm; Manufacturer_Part_Number: MC74HC4051ADG; Mouser Part Number: 863-MC74HC4051ADG; Mouser Price/Stock: https://www.mouser.co.uk/ProductDetail/onsemi/MC74HC4051ADG?qs=qg33o%252B8vzFpcQCvHK306Qw%3D%3D; Arrow Part Number: MC74HC4051ADG; Arrow Price/Stock: https://www.arrow.com/en/products/mc74hc4051adg/on-semiconductor?region=europe
IC?#3 = 74HC1G125GV,125: Integrated Circuit; Manufacturer_Name: Nexperia; Datasheet Link: https://assets.nexperia.com/documents/data-sheet/74HC_HCT1G125.pdf; Height: 1.1mm; Manufacturer_Part_Number: 74HC1G125GV,125; Mouser Part Number: 771-HC1G125GV125; Mouser Price/Stock: https://www.mouser.co.uk/ProductDetail/Nexperia/74HC1G125GV125?qs=P62ublwmbi8%2FUHtIGJBBBA%3D%3D; Arrow Part Number: 74HC1G125GV,125; Arrow Price/Stock: https://www.arrow.com/en/products/74hc1g125gv125/nexperia?region=nac
IC?#4 = 74HC4066D: Integrated Circuit; Manufacturer_Name: Toshiba; Datasheet Link: http://toshiba.semicon-storage.com/info/docget.jsp?did=55443&prodName=74HC4066D; Height: 1.75mm; Manufacturer_Part_Number: 74HC4066D; Mouser Part Number: 757-74HC4066D; Mouser Price/Stock: https://www.mouser.co.uk/ProductDetail/Toshiba/74HC4066D?qs=xhbEVWpZdWfnVpwzPJU8TQ%3D%3D; Arrow Part Number: 74HC4066D; Arrow Price/Stock: https://www.arrow.com/en/products/74hc4066d/toshiba?region=nac
IC?#5 = TLC3702CD: Integrated Circuit; Manufacturer_Name: Texas Instruments; Datasheet Link: http://www.ti.com/lit/ds/symlink/tlc3702.pdf; Height: 1.75mm; Manufacturer_Part_Number: TLC3702CD; Mouser Part Number: 595-TLC3702CD; Mouser Price/Stock: https://www.mouser.co.uk/ProductDetail/Texas-Instruments/TLC3702CD?qs=N6WZOzgtpqUl9Z8VNC%252BKqA%3D%3D; Arrow Part Number: TLC3702CD; Arrow Price/Stock: https://www.arrow.com/en/products/tlc3702cd/texas-instruments?region=nac
R?#5-R?#12 = Res1: Resistor; Published: 8-Jun-2000; LatestRevisionDate: 17-Jul-2002; LatestRevisionNote: Re-released for DXP Platform.; PackageReference: AXIAL-0.3; Publisher: Altium Limited; PackageDescription: Axial Device, Thru-Hole; 2 Leads; 0.3 in Pin Spacing

## Sheet EndStops.SchDoc
size B
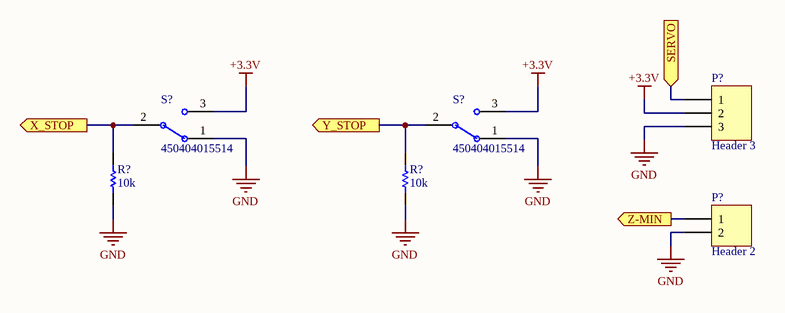
[diagram p5: EndStops.SchDoc]

### Parts
(Parts that share a designator on the sheet are numbered #1, #2 ... from top to bottom, then left to right.)
P?#3  Header 3  [HDR1X3]
P?#4  Header 2  [HDR1X2]
R?#13  value 10k  [AXIAL-0.3]  (hidden comment: Res1)
R?#14  value 10k  [AXIAL-0.3]  (hidden comment: Res1)
S?#1  450404015514  [WURTH WS-SLSU 450404015514]
S?#2  450404015514  [WURTH WS-SLSU 450404015514]

### Ports
SERVO (in), X_STOP (out), Y_STOP (out), Z-MIN (out)

### Nets
+3.3V: P?#3.2 S?#1.3 S?#2.3
GND: P?#3.3 P?#4.2 R?#13.1 R?#14.1 S?#1.1 S?#2.1
NetP?#3_1: P?#3.1 ; port SERVO
NetP?#4_1: P?#4.1 ; port Z-MIN
NetR?#13_2: R?#13.2 S?#1.2(COM) ; port X_STOP
NetR?#14_2: R?#14.2 S?#2.2(COM) ; port Y_STOP

### Library data of the parts
P?#3 = Header 3: Header, 3-Pin; LatestRevisionDate: 17-Jul-2002; LatestRevisionNote: Re-released for DXP Platform.; Publisher: Altium Limited
P?#4 = Header 2: Header, 2-Pin; LatestRevisionDate: 17-Jul-2002; LatestRevisionNote: Re-released for DXP Platform.; Publisher: Altium Limited
R?#13 R?#14 = Res1: Resistor; Published: 8-Jun-2000; LatestRevisionDate: 17-Jul-2002; LatestRevisionNote: Re-released for DXP Platform.; PackageReference: AXIAL-0.3; Publisher: Altium Limited; PackageDescription: Axial Device, Thru-Hole; 2 Leads; 0.3 in Pin Spacing
S?#1 S?#2 = 450404015514: MINI SLIDE SWITCH 6.7 X 2.7 MM.; Manufacturer: Würth Elektronik; Rated Current: 300mA; Rated Voltage: 5VDC; Switching Function: On-On; Circuit: SPDT; Actuator Length: 1.50mm; Actuator Type: Standard; Contact Timing: Non-Shorting (BBM); Current Rating (Amps): 300mA (DC); Voltage Rating - DC: 5 V; ComponentLink1Description: Datasheet; ComponentLink1URL: https://katalog.we-online.de/em/datasheet/450404015514.pdf; ComponentLink2Description: DigiKey Link; ComponentLink2URL: https://www.digikey.com/en/products/detail/würth-elektronik/450404015514/9950812; Packaging: TapeAndReel; Publisher: Wurth Elektronik; Contact Material: Copper Alloy; Mounting Technology: SMT; Operating Temperature: -40°C ~ 85°C; Contact Plating: Silver; Part Number: 450404015514; Published Date: September 2019; Terminal Material: Copper Alloy; Size: 6.7x2.7mm; Terminal Plating: Silver; Contact Finish: Silver; LastUpdated: 20.06.2022 13:21:56; Lifecycle Status: Active; Minimum Order: 1; Mounting Type: Surface Mount; PartId: 5; Part Status: Active; Price: 0.48; Series: WS-SLSU; Supplier 1: DigiKey; Supplier Part Number 1: 732-13665-1-ND; Switch Function: On-On; Termination Style: SMD (SMT) Tab

## Sheet PowerConversion.SchDoc
size B
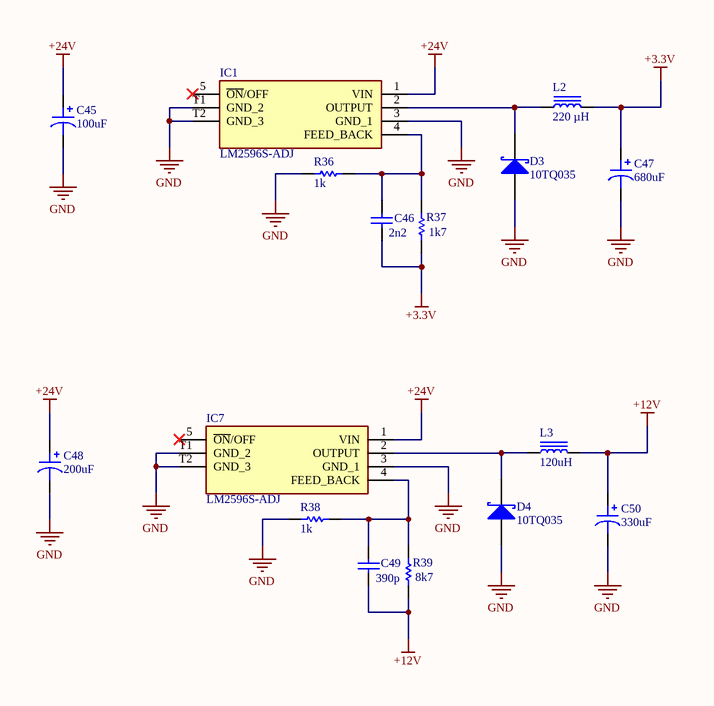
[diagram p6: PowerConversion.SchDoc]

### Parts
C45  100uF  [CAP ALSMD 8.3MM H10.5MM]
C46  value 2n2  [RAD-0.3]  (hidden comment: Cap)
C47  680uF  [CAP ALSMD 8.3MM H10.5MM]
C48  200uF  [CAP ALSMD 8.3MM H10.5MM]
C49  value 390p  [RAD-0.3]  (hidden comment: Cap)
C50  330uF  [CAP ALSMD 8.3MM H10.5MM]
D3  10TQ035  [TO-220AC]
D4  10TQ035  [TO-220AC]
IC1  LM2596S-ADJ  [LM2596SXADJ]
IC7  LM2596S-ADJ  [LM2596SXADJ]
L2  220 µH  [WURTH WE-PD 1260]
L3  120uH  [WURTH WE-PD 1260]
R36  value 1k  [AXIAL-0.3]  (hidden comment: Res1)
R37  value 1k7  [AXIAL-0.3]  (hidden comment: Res1)
R38  value 1k  [AXIAL-0.3]  (hidden comment: Res1)
R39  value 8k7  [AXIAL-0.3]  (hidden comment: Res1)

### Nets
+3.3V: C46.1 C47.1 L2.2 R37.1
+12V: C49.1 C50.1 L3.2 R39.1
+24V: C45.1 C48.1 IC1.1(VIN) IC7.1(VIN)  [project net VS]
GND: C45.2 C47.2 C48.2 C50.2 D3.3(A) D4.3(A) IC1.3(GND_1) IC1.T1(GND_2) IC1.T2(GND_3) IC7.3(GND_1) IC7.T1(GND_2) IC7.T2(GND_3) R36.2 R38.2
NetC46_2: C46.2 IC1.4(FEED_BACK) R36.1 R37.2
NetC49_2: C49.2 IC7.4(FEED_BACK) R38.1 R39.2
NetD3_1: D3.1(K) IC1.2(OUTPUT) L2.1
NetD4_1: D4.1(K) IC7.2(OUTPUT) L3.1

Not connected (* = marked no-connect by the designer): IC1 5(~{ON}/OFF)*; IC7 5(~{ON}/OFF)*

### Library data of the parts
C45 C47 C48 C50 = UUX1V101MNL6GS: as C1 on sheet Temperature; Part Number: UUX1V101MNL6GS; Applications: General Purpose; componentlink1description: Datasheet; componentlink1url: http://nichicon-us.com/english/products/pdfs/e-uux.pdf; componentlink2description: DigiKey Link; componentlink2url: http://digikey.com/product-detail/en/nichicon/UUX1V101MNL6GS/493-6276-1-ND/3438789; Device Package: Radial, Can - SMD; Height - Seated (Max): 0.413" (10.50mm); lastupdated: 02.09.2020 01:25:15; Lifecycle Status: Active; Minimum Order: 1; Mounting Type: Surface Mount; Operating Temperature: -55°C ~ 105°C; Package / Case: Radial, Can - SMD; packaging: TapeAndReel; partid: 7565; Part Status: Active; price: 0.19; series: UUX; Size / Dimension: 0.315" Dia (8.00mm); Supplier 1: DigiKey; Supplier Part Number 1: 493-6276-1-ND; Tolerance: ±20%; Voltage - Rated: 35V
C46 C49 = Cap: Capacitor; Published: 8-Jun-2000; LatestRevisionDate: 17-Jul-2002; LatestRevisionNote: Re-released for DXP Platform.; PackageReference: RAD-0.3; Publisher: Altium Limited; PackageDescription: Radial Cap, Thru-Hole; 2 Leads; 0.3 in Pin Spacing
D3 D4 = Diode 10TQ035: as D? on sheet Motherboard; Published: 8-Jun-2000; LatestRevisionDate: 17-Jul-2002; LatestRevisionNote: Re-released for DXP Platform.; DatasheetVersion: PD-2.057B; PackageVersion: Feb-1998; PackageReference: TO-220AC; Publisher: Altium Limited; PackageDescription: TO, Thru-Hole, Vertical, Heatsink Mounted; 3 In-Line Leads (1 Absent); Pitch 2.54 mm; ComponentLink1Description: Manufacturer Link; ComponentLink1URL: http://www.irf.com/; ComponentLink2Description: Datasheet; ComponentLink2URL: http://www.irf.com/product-info/datasheets/data/10tq.pdf
IC1 IC7 = LM2596S-ADJ: Integrated Circuit; Manufacturer_Name: Texas Instruments; Datasheet Link: https://www.ti.com/lit/ds/symlink/lm2596.pdf?HQS=ti-null-null-sf-df-pf-sep-wwe&ts=1592978195629; Height: 4.57mm; Manufacturer_Part_Number: LM2596S-ADJ; Mouser Part Number: 926-LM2596S-ADJ; Mouser Price/Stock: https://www.mouser.co.uk/ProductDetail/Texas-Instruments/LM2596S-ADJ?qs=X1J7HmVL2ZGmRmhAtwKZ2Q%3D%3D
L2 = 744771220: FIXED IND 220UH 960MA 400MOHM SM; Manufacturer: Würth Elektronik; Current - Saturation: 1.2A; DC Resistance (DCR): 400mOhm Max; Frequency - Self Resonant: 3.8MHz; Inductance Frequency - Test: 1 kHz; Material - Core: Ferrite; Shielding: Shielded; Tolerance: ±20%; Type: Drum Core, Wirewound; Part Number: 744771220; ComponentLink1Description: Datasheet; ComponentLink1URL: https://katalog.we-online.de/pbs/datasheet/744771220.pdf; ComponentLink2Description: DigiKey Link; ComponentLink2URL: https://www.digikey.com/en/products/detail/würth-elektronik/744771220/3316840; Current Rating (Amps): 960 mA; Device Package: Nonstandard; Height - Seated (Max): 0.236" (6.00mm); Inductance: 220 µH; LastUpdated: 13.09.2022 07:46:15; Lifecycle Status: Active; Minimum Order: 1; Mounting Type: Surface Mount; Operating Temperature: -40°C ~ 125°C; Package / Case: Nonstandard; Packaging: TapeAndReel; PartId: 5733; Part Status: Active; Price: 1.18; Ratings: AEC-Q200; Series: WE-PD; Size / Dimension: 0.472" L x 0.472" W (12.00mm x 12.00mm); Supplier 1: DigiKey; Supplier Part Number 1: 732-4025-1-ND; Value: 220 µH
L3 = 744771220: FIXED IND 220UH 960MA 400MOHM SM; Manufacturer: Würth Elektronik; Current - Saturation: 1.2A; DC Resistance (DCR): 400mOhm Max; Frequency - Self Resonant: 3.8MHz; Inductance: 220 µH; Inductance Frequency - Test: 1 kHz; Material - Core: Ferrite; Shielding: Shielded; Tolerance: ±20%; Type: Drum Core, Wirewound; Value: 220 µH; Part Number: 744771220; ComponentLink1Description: Datasheet; ComponentLink1URL: https://katalog.we-online.de/pbs/datasheet/744771220.pdf; ComponentLink2Description: DigiKey Link; ComponentLink2URL: https://www.digikey.com/en/products/detail/würth-elektronik/744771220/3316840; Current Rating (Amps): 960 mA; Device Package: Nonstandard; Height - Seated (Max): 0.236" (6.00mm); LastUpdated: 13.09.2022 07:46:15; Lifecycle Status: Active; Minimum Order: 1; Mounting Type: Surface Mount; Operating Temperature: -40°C ~ 125°C; Package / Case: Nonstandard; Packaging: TapeAndReel; PartId: 5733; Part Status: Active; Price: 1.18; Ratings: AEC-Q200; Series: WE-PD; Size / Dimension: 0.472" L x 0.472" W (12.00mm x 12.00mm); Supplier 1: DigiKey; Supplier Part Number 1: 732-4025-1-ND
R36-R39 = Res1: Resistor; Published: 8-Jun-2000; LatestRevisionDate: 17-Jul-2002; LatestRevisionNote: Re-released for DXP Platform.; PackageReference: AXIAL-0.3; Publisher: Altium Limited; PackageDescription: Axial Device, Thru-Hole; 2 Leads; 0.3 in Pin Spacing

## Nets that join several sheets
+3.3V: TMC2208_1 (5 pins), TMC2208_2 (5 pins), TMC2208_3 (5 pins), TMC2208_4 (5 pins), Temperature (R3.2 R26.2), StepperMotorLogic (11 pins), EndStops (P?#3.2 S?#1.3 S?#2.3), PowerConversion (C46.1 C47.1 L2.2 R37.1)
GND: TMC2208_1 (26 pins), TMC2208_2 (26 pins), TMC2208_3 (26 pins), TMC2208_4 (26 pins), STM32 (35 pins), Temperature (25 pins), StepperMotorLogic (20 pins), EndStops (6 pins), PowerConversion (14 pins)
VS: TMC2208_1 (6 pins), TMC2208_2 (6 pins), TMC2208_3 (6 pins), TMC2208_4 (6 pins), Temperature (12 pins), PowerConversion (C45.1 C48.1 IC1.1 IC7.1)
DIR: TMC2208_1 (IC1_TMC2208_1.19 R23_TMC2208_1.1), STM32 (U2.11)
DIR: TMC2208_2 (IC1_TMC2208_2.19 R23_TMC2208_2.1), STM32 (U2.12)
DIR: TMC2208_3 (IC1_TMC2208_3.19 R23_TMC2208_3.1), STM32 (U2.13)
DIR: TMC2208_4 (IC1_TMC2208_4.19 R23_TMC2208_4.1), STM32 (U2.20)
ENN: Motherboard (D?.1), TMC2208_1 (IC1_TMC2208_1.2 R4_TMC2208_1.2), TMC2208_2 (IC1_TMC2208_2.2 R4_TMC2208_2.2), TMC2208_3 (IC1_TMC2208_3.2 R4_TMC2208_3.2), TMC2208_4 (IC1_TMC2208_4.2 R4_TMC2208_4.2), StepperMotorLogic (IC?#5.1)
MPLX_A: STM32 (U2.18), StepperMotorLogic (IC?#2.11 R?#8.2)
MPLX_B: STM32 (U2.19), StepperMotorLogic (IC?#2.10 R?#7.2)
Net1_1: STM32 (U2.26), Temperature (1.1 C2.2 R3.1)
NetC10_TMC2208_4_2: Motherboard (P4.4), TMC2208_4 (5 pins)
NetC11_TMC2208_4_2: Motherboard (P4.3), TMC2208_4 (5 pins)
NetC12_TMC2208_4_1: Motherboard (P4.2), TMC2208_4 (5 pins)
NetC13_TMC2208_4_1: Motherboard (P4.1), TMC2208_4 (5 pins)
NetC42_2: STM32 (U2.27), Temperature (C42.2 P3.1 R26.1)
NetD?_3: Motherboard (D?.3), STM32 (U2.10)
NetIC1_TMC2208_1_11: TMC2208_1 (IC1_TMC2208_1.11), StepperMotorLogic (IC?#1.2)
NetIC1_TMC2208_2_11: TMC2208_2 (IC1_TMC2208_2.11), StepperMotorLogic (IC?#1.3)
NetIC1_TMC2208_3_11: TMC2208_3 (IC1_TMC2208_3.11), StepperMotorLogic (IC?#1.4)
NetIC1_TMC2208_4_11: TMC2208_4 (IC1_TMC2208_4.11), StepperMotorLogic (IC?#1.5)
NetP?#3_1: STM32 (U2.35), EndStops (P?#3.1)
NetP?#4_1: STM32 (U2.21), EndStops (P?#4.1)
NetR2_2: STM32 (U2.2), Temperature (5 pins)
NetR23_2: STM32 (U2.4), Temperature (R23.2 R25.2)
NetR31_2: STM32 (U2.3), Temperature (5 pins)
NetR?#1_2: STM32 (U2.5), Temperature (R?#1.2 R?#3.2)
NetR?#2_2: STM32 (U2.41), Temperature (R?#2.2 R?#4.2)
NetR?#13_2: STM32 (U2.14), EndStops (R?#13.2 S?#1.2)
NetR?#14_2: STM32 (U2.15), EndStops (R?#14.2 S?#2.2)
PDN1: TMC2208_1 (IC1_TMC2208_1.14 R5_TMC2208_1.2), StepperMotorLogic (IC?#4.1)
PDN2: TMC2208_2 (IC1_TMC2208_2.14 R5_TMC2208_2.2), StepperMotorLogic (IC?#4.4)
PDN3: TMC2208_3 (IC1_TMC2208_3.14 R5_TMC2208_3.2), StepperMotorLogic (IC?#4.8)
PDN4: TMC2208_4 (IC1_TMC2208_4.14 R5_TMC2208_4.2), StepperMotorLogic (IC?#4.11)
STEP1: TMC2208_1 (IC1_TMC2208_1.16), STM32 (U2.96)
STEP2: TMC2208_2 (IC1_TMC2208_2.16), STM32 (U2.43)
STEP3: TMC2208_3 (IC1_TMC2208_3.16), STM32 (U2.46)
STEP4: TMC2208_4 (IC1_TMC2208_4.16), STM32 (U2.47)
UART4_RX: STM32 (U2.112), StepperMotorLogic (5 pins)
UART4_TX: STM32 (U2.34), StepperMotorLogic (IC?#3.2)